# EAGLE design G-MAS SHIELD (EAGLE 9.4.2)
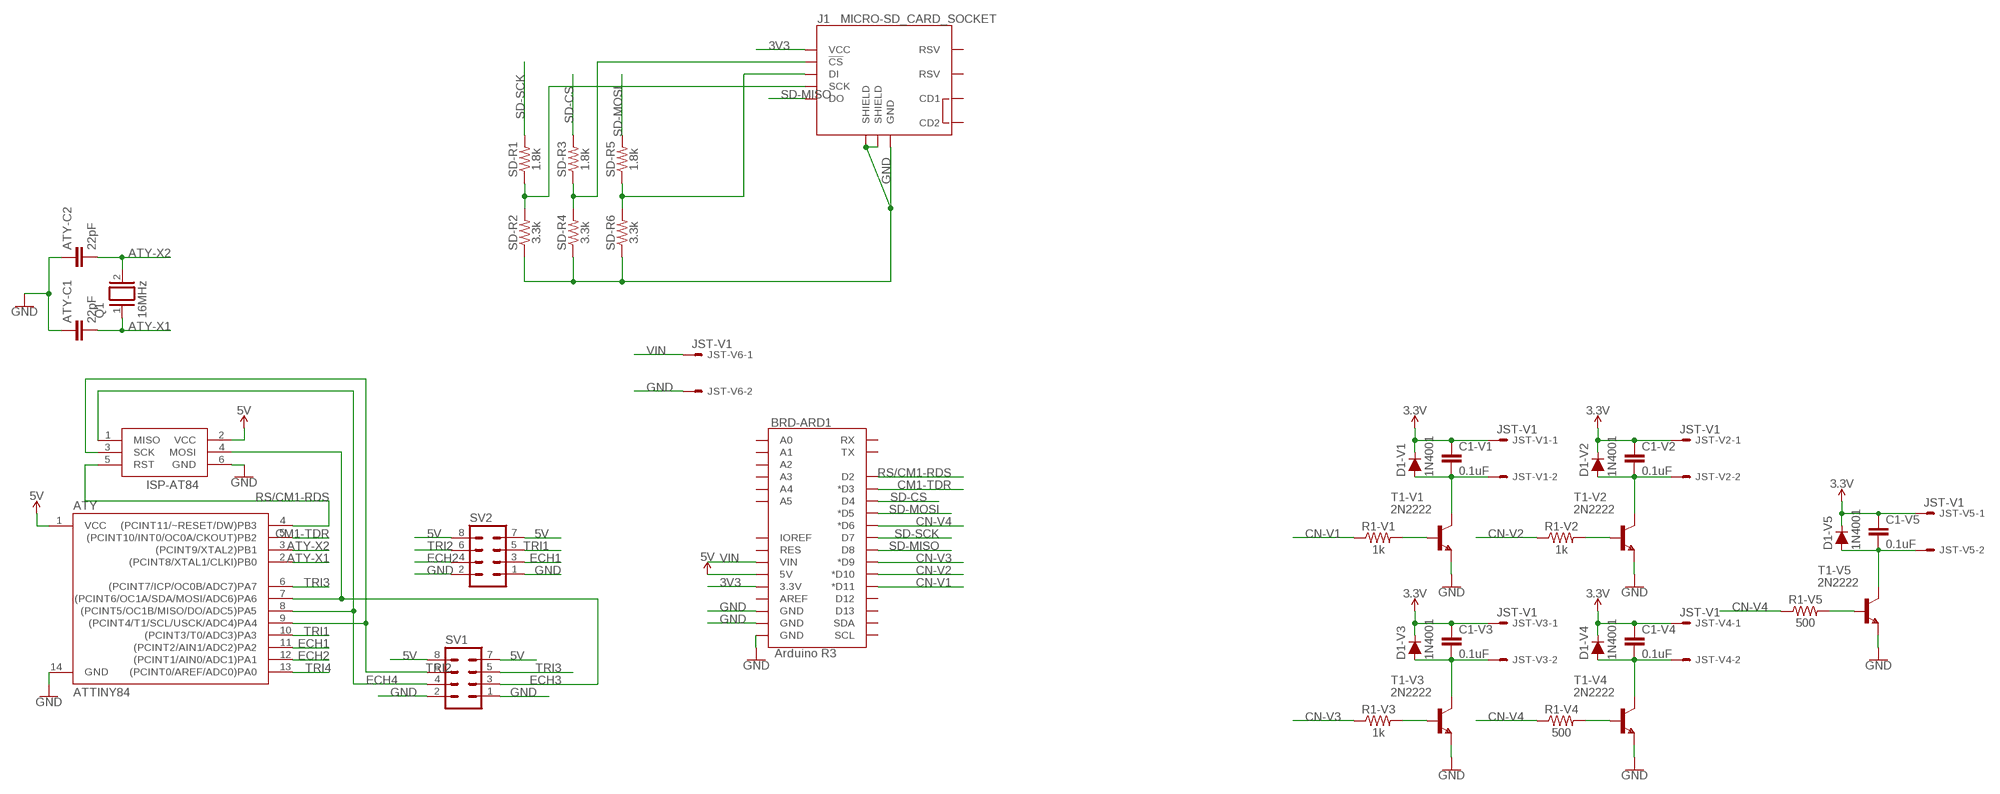
[diagram p0: schematic, sheet 1]

## Parts
ATY  ATTINY84  ATTINY84ATTINY84-20PU  [DIP14]
ATY-C1  22pF  0.1UF-KIT-EZ-50V-20%  [CAP-PTH-SMALL-KIT]
ATY-C2  22pF  0.1UF-KIT-EZ-50V-20%  [CAP-PTH-SMALL-KIT]
BRD-ARD1  Arduino R3  ARDUINO_UNO_R3_SHIELDNOLABELS  [UNO_R3_SHIELD_NOLABELS]
C1-V1  0.1uF  0.1UF-KIT-EZ-50V-20%  [CAP-PTH-SMALL-KIT]
C1-V2  0.1uF  0.1UF-KIT-EZ-50V-20%  [CAP-PTH-SMALL-KIT]
C1-V3  0.1uF  0.1UF-KIT-EZ-50V-20%  [CAP-PTH-SMALL-KIT]
C1-V4  0.1uF  0.1UF-KIT-EZ-50V-20%  [CAP-PTH-SMALL-KIT]
C1-V5  0.1uF  0.1UF-KIT-EZ-50V-20%  [CAP-PTH-SMALL-KIT]
D1-V1  1N4001  DIODE-PTH  [DIODE-1N4001]
D1-V2  1N4001  DIODE-PTH  [DIODE-1N4001]
D1-V3  1N4001  DIODE-PTH  [DIODE-1N4001]
D1-V4  1N4001  DIODE-PTH  [DIODE-1N4001]
D1-V5  1N4001  DIODE-PTH  [DIODE-1N4001]
ISP-AT84  AVRISP-6  [AVRISP]
J1  MICRO-SD_CARD_SOCKET  [MICRO-SD-SOCKET]
JST-V1  JST-V1  JST-XH-02-PIN-LONG-PAD  [JST-XH-02-PACKAGE-LONG-PAD]
JST-V2  JST-V1  JST-XH-02-PIN-LONG-PAD  [JST-XH-02-PACKAGE-LONG-PAD]
JST-V3  JST-V1  JST-XH-02-PIN-LONG-PAD  [JST-XH-02-PACKAGE-LONG-PAD]
JST-V4  JST-V1  JST-XH-02-PIN-LONG-PAD  [JST-XH-02-PACKAGE-LONG-PAD]
JST-V5  JST-V1  JST-XH-02-PIN-LONG-PAD  [JST-XH-02-PACKAGE-LONG-PAD]
JST-V6  JST-V1  JST-XH-02-PIN-LONG-PAD  [JST-XH-02-PACKAGE-LONG-PAD]
Q1  16MHz  XTAL/S  [QS]
R1-V1  1k  1KOHM-HORIZ-1/4W-1%  [AXIAL-0.3]
R1-V2  1k  1KOHM-HORIZ-1/4W-1%  [AXIAL-0.3]
R1-V3  1k  1KOHM-HORIZ-1/4W-1%  [AXIAL-0.3]
R1-V4  500  1KOHM-HORIZ-1/4W-1%  [AXIAL-0.3]
R1-V5  500  1KOHM-HORIZ-1/4W-1%  [AXIAL-0.3]
SD-R1  1.8k  1.8KOHM-0603-1/10W-1%  [0603]
SD-R2  3.3k  3.3KOHM-0603-1/10W-1%  [0603]
SD-R3  1.8k  1.8KOHM-0603-1/10W-1%  [0603]
SD-R4  3.3k  3.3KOHM-0603-1/10W-1%  [0603]
SD-R5  1.8k  1.8KOHM-0603-1/10W-1%  [0603]
SD-R6  3.3k  3.3KOHM-0603-1/10W-1%  [0603]
SV1  MA04-2  [MA04-2]
SV2  MA04-2  [MA04-2]
T1-V1  2N2222  [TO92-EBC-OVAL]
T1-V2  2N2222  [TO92-EBC-OVAL]
T1-V3  2N2222  [TO92-EBC-OVAL]
T1-V4  2N2222  [TO92-EBC-OVAL]
T1-V5  2N2222  [TO92-EBC-OVAL]

## Nets
3.3V: C1-V1.1 C1-V2.1 C1-V3.1 C1-V4.1 C1-V5.1 D1-V1.C D1-V2.C D1-V3.C D1-V4.C D1-V5.C JST-V1.1 JST-V2.1 JST-V3.1 JST-V4.1 JST-V5.1
3V3: BRD-ARD1.3.3V J1.VCC
5V: ATY.1(VCC) BRD-ARD1.5V ISP-AT84.2(VCC) SV1.7 SV1.8 SV2.7 SV2.8
ATY-X1: ATY-C1.2 ATY.2((PCINT8/XTAL1/CLKI)PB0) Q1.1
ATY-X2: ATY-C2.2 ATY.3((PCINT9/XTAL2)PB1) Q1.2
CM1-TDR: ATY.5((PCINT10/INT0/OC0A/CKOUT)PB2) BRD-ARD1.D3(*D3)
CN-V1: BRD-ARD1.D11(*D11) R1-V1.P$1
CN-V2: BRD-ARD1.D10(*D10) R1-V2.P$1
CN-V3: BRD-ARD1.D9(*D9) R1-V3.P$1
CN-V4: BRD-ARD1.D6(*D6) R1-V4.P$1 R1-V5.P$1
ECH1: ATY.11((PCINT2/AIN1/ADC2)PA2) SV2.3
ECH2: ATY.12((PCINT1/AIN0/ADC1)PA1) SV2.4
ECH3: ATY.7((PCINT6/OC1A/SDA/MOSI/ADC6)PA6) ISP-AT84.4(MOSI) SV1.3
ECH4: ATY.8((PCINT5/OC1B/MISO/DO/ADC5)PA5) ISP-AT84.1(MISO) SV1.4
GND: ATY-C1.1 ATY-C2.1 ATY.14(GND) BRD-ARD1.GND@0(GND) BRD-ARD1.GND@1(GND) BRD-ARD1.GND@2(GND) ISP-AT84.6(GND) J1.GND J1.GND1(SHIELD) J1.GND3(SHIELD) JST-V6.2 SD-R2.1 SD-R4.1 SD-R6.1 SV1.1 SV1.2 SV2.1 SV2.2 T1-V1.E T1-V2.E T1-V3.E T1-V4.E T1-V5.E
N$1: C1-V1.2 D1-V1.A JST-V1.2 T1-V1.C
N$2: C1-V2.2 D1-V2.A JST-V2.2 T1-V2.C
N$3: R1-V1.P$2 T1-V1.B
N$4: R1-V2.P$2 T1-V2.B
N$5: C1-V3.2 D1-V3.A JST-V3.2 T1-V3.C
N$6: R1-V3.P$2 T1-V3.B
N$7: C1-V4.2 D1-V4.A JST-V4.2 T1-V4.C
N$8: R1-V4.P$2 T1-V4.B
N$9: C1-V5.2 D1-V5.A JST-V5.2 T1-V5.C
N$10: R1-V5.P$2 T1-V5.B
N$11: J1.SCLK(SCK) SD-R1.1 SD-R2.2
N$12: J1.CS(!CS) SD-R3.1 SD-R4.2
N$13: J1.DI SD-R5.1 SD-R6.2
RS/CM1-RDS: ATY.4((PCINT11/~RESET/DW)PB3) BRD-ARD1.D2 ISP-AT84.5(RST)
SD-CS: BRD-ARD1.D4 SD-R3.2
SD-MISO: BRD-ARD1.D8 J1.DO
SD-MOSI: BRD-ARD1.D5(*D5) SD-R5.2
SD-SCK: BRD-ARD1.D7 SD-R1.2
TRI1: ATY.10((PCINT3/T0/ADC3)PA3) SV2.5
TRI2: ATY.13((PCINT0/AREF/ADC0)PA0) SV2.6
TRI3: ATY.6((PCINT7/ICP/OC0B/ADC7)PA7) SV1.5
TRI4: ATY.9((PCINT4/T1/SCL/USCK/ADC4)PA4) ISP-AT84.3(SCK) SV1.6
VIN: BRD-ARD1.VIN JST-V6.1
Unconnected: BRD-ARD1.A0 BRD-ARD1.A1 BRD-ARD1.A2 BRD-ARD1.A3 BRD-ARD1.A4 BRD-ARD1.A5 BRD-ARD1.AREF BRD-ARD1.D12 BRD-ARD1.D13 BRD-ARD1.IOREF BRD-ARD1.RES BRD-ARD1.RX BRD-ARD1.SCL BRD-ARD1.SDA BRD-ARD1.TX J1.CD1 J1.CD2 J1.RSV1(RSV) J1.RSV2(RSV)

## Library data of the parts
ATY = SparkFun-IC-Microcontroller:ATTINY84: Atmel 14-pin 2/4/8kB flash uC Datasheet <https://cdn.sparkfun.com/datasheets/Widgets/doc8006.pdf> SparkFun Products Tiny AVR Programmer <https://www.sparkfun.com/products/11801> (PGM-11801) SparkFun Servo Trigger - Continuous Rotation <https://www.sparkfun.com/products/13872> (WIG-13872) SparkFun Servo Trigger <https://www.sparkfun.com/products/13118> (WIG-13118)
ATY-C1 ATY-C2 = SparkFun-Capacitors:0.1UF: 0.1µF ceramic capacitors A capacitor is a passive two-terminal electrical component used to store electrical energy temporarily in an electric field.; PROD_ID: CAP-08370; VALUE: 0.1uF
BRD-ARD1 = SparkFun-Boards:ARDUINO_UNO_R3_SHIELD: Arduino R3 Shield Footprint Shield form compatible with the Arduino Uno R3. SparkFun Products: MG2639 Cellular Shield <https://www.sparkfun.com/products/13120> MIDI Shield <https://www.sparkfun.com/products/12898> R3 Stackable Headers Kit <https://www.sparkfun.com/products/11417>
C1-V1-C1-V5 = SparkFun-Capacitors:0.1UF: 0.1µF ceramic capacitors A capacitor is a passive two-terminal electrical component used to store electrical energy temporarily in an electric field.; PROD_ID: CAP-08370
D1-V1-D1-V5 = SparkFun-DiscreteSemi:DIODE: Diode These are standard reverse protection diodes and small signal diodes. SparkFun Products: SparkFun SparkPunk Sound Kit <https://www.sparkfun.com/products/11177> SparkFun ESP8266 Thing <https://www.sparkfun.com/products/13231>; PROD_ID: DIO-09176; VALUE: 1A/50V/1.1V
ISP-AT84 = adafruit:AVRISP: AVR ISP HEADER Standard 6 pin header for AVR programming
J1 = SparkFun-Connectors:MICRO-SD_CARD_SOCKET: microSD Socket for Transflash Push-push type µSD socket. tDoc lines correctly indicate media card edge positions when inserting (unlocked, locked, depressed). NOTE: CD1 and CD2 are connected internally, and the default detect state of the socket is detect pin to ground. SparkFun Products: WAV Trigger <https://www.sparkfun.com/products/13660> CAN-Bus Shield <https://www.sparkfun.com/products/13262> SparkFun Level Shifing microSD Breakout <https://www.sparkfun.com/products/13743>; PROD_ID: CONN-07820; SF_ID: PRT-00127
JST-V1-JST-V6 = Rembrandt Electronics - JST XH Connectors v1-0:JST-XH-02-PIN: JST XH Connector 2 Pin Wire to board connector. Pitch: 2,54 mm, (0.100") Number of pins: 2 Created by Rembrandt Electronics www.rembrandtelectronics.com
Q1 = special:XTAL/S: CRYSTAL
R1-V1-R1-V3 = SparkFun-Resistors:1KOHM: 1kΩ resistor A resistor is a passive two-terminal electrical component that implements electrical resistance as a circuit element. Resistors act to reduce current flow, and, at the same time, act to lower voltage levels within circuits. - Wikipedia; PROD_ID: RES-12182
R1-V4 R1-V5 = SparkFun-Resistors:1KOHM: 1kΩ resistor A resistor is a passive two-terminal electrical component that implements electrical resistance as a circuit element. Resistors act to reduce current flow, and, at the same time, act to lower voltage levels within circuits. - Wikipedia; PROD_ID: RES-12182; VALUE: 1k
SD-R1 SD-R3 SD-R5 = SparkFun-Resistors:1.8KOHM: 1.8kΩ resistor A resistor is a passive two-terminal electrical component that implements electrical resistance as a circuit element. Resistors act to reduce current flow, and, at the same time, act to lower voltage levels within circuits. - Wikipedia; PROD_ID: RES-09119
SD-R2 SD-R4 SD-R6 = SparkFun-Resistors:3.3KOHM: 3.3kΩ resistor A resistor is a passive two-terminal electrical component that implements electrical resistance as a circuit element. Resistors act to reduce current flow, and, at the same time, act to lower voltage levels within circuits. - Wikipedia; PROD_ID: RES-07851
SV1 SV2 = con-lstb:MA04-2: PIN HEADER; OC_FARNELL: unknown; OC_NEWARK: unknown
T1-V1-T1-V5 = adafruit:2N2222: NPN TRANSISTOR Big oval pads

## Net classes
0 default: width 1.016 mm, clearance 0.635 mm

## Board
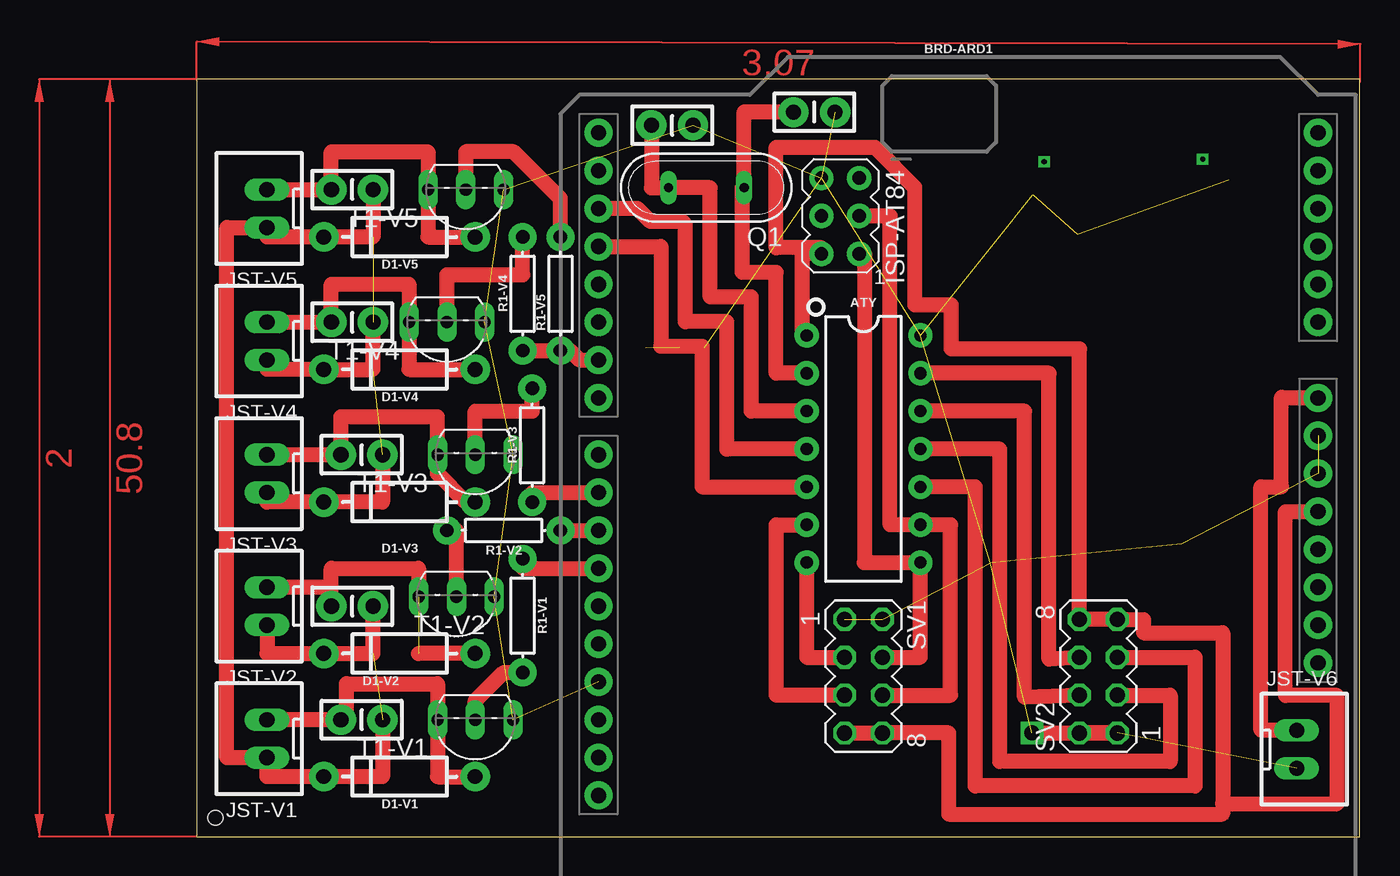
[diagram p1: board, top side]
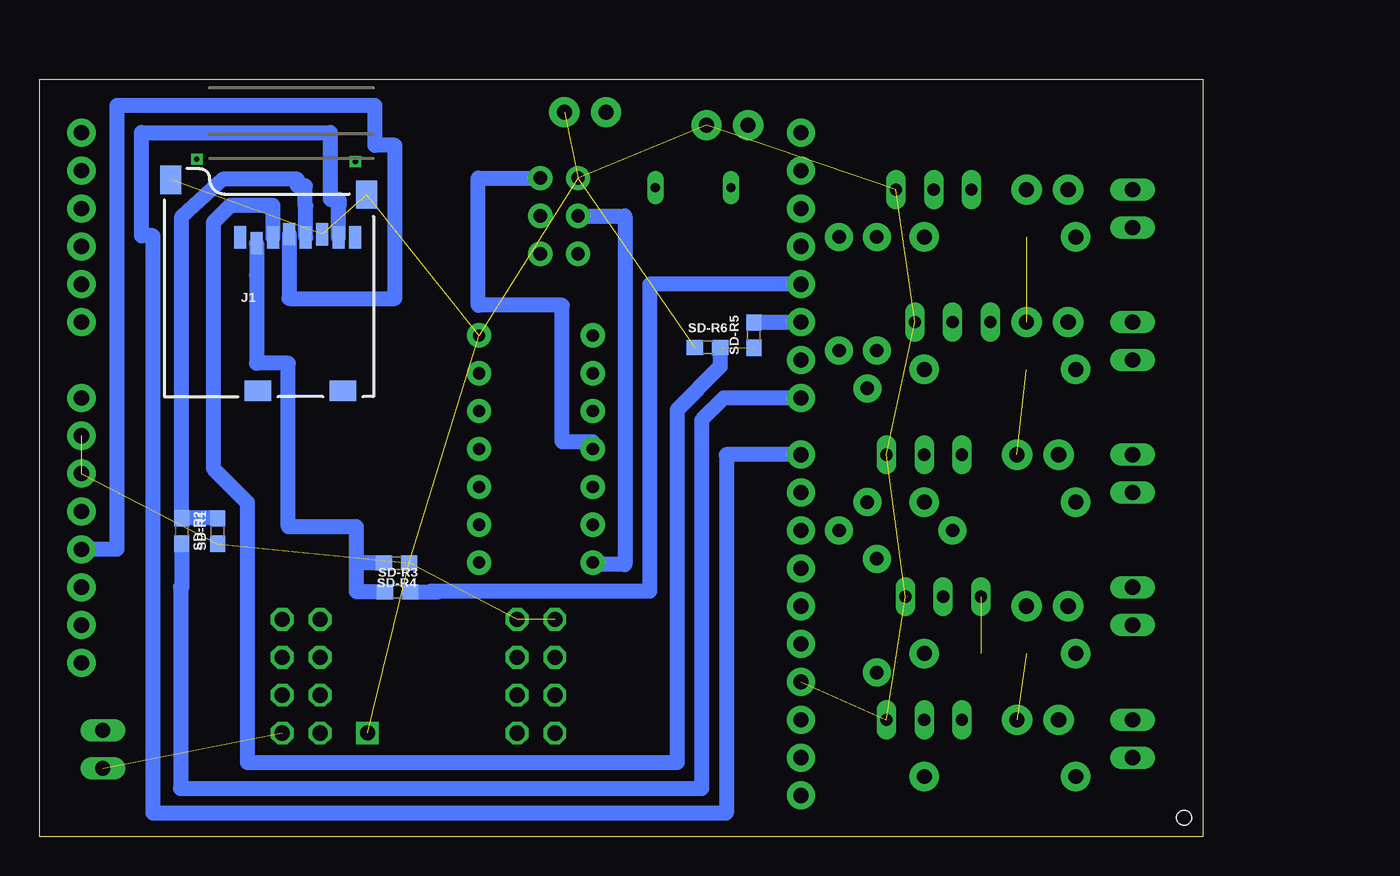
[diagram p2: board, bottom side, seen from below]

Size 78 x 50.8 mm. Coordinates in mm from the lower left corner, seen from the top.
Outline: 0,0 78,0 78,50.8 0,50.8 0,0
Copper layers (1*16): Top 0.035mm / dielectric 1.5mm / Bottom 0.035mm
Design rules "default": minimum track width 6mil, minimum drill 0.35mm, track to track 6mil, track to pad 6mil, pad to pad 6mil, via to via 6mil, smd to smd 6mil, copper to edge 40mil, drill to drill 6mil, minimum pad ring 10mil, minimum via ring 8mil, stop-mask expansion 4mil, vias tented up to drill 0mil, thermal gap 10mil
Holes 1 mm at 1.27,1.27

### Footprints (pad centres in the part's own frame; a part is rotated, then mirrored left to right if it is on the bottom)
DIP14 = drill 0.813 pad 1.626: 1 -7.62,-3.81; 2 -5.08,-3.81; 3 -2.54,-3.81; 4 0,-3.81; 5 2.54,-3.81; 6 5.08,-3.81; 7 7.62,-3.81; 8 7.62,3.81; 9 5.08,3.81; 10 2.54,3.81; 11 0,3.81; 12 -2.54,3.81; 13 -5.08,3.81; 14 -7.62,3.81
CAP-PTH-SMALL-KIT = drill 1.016 pad 2.032: 1 -1.397,0; 2 1.397,0
UNO_R3_SHIELD_NOLABELS = drill 1.016 pad 1.88: 3.3V 24.13,-3.81; 5V 24.13,-1.27; A0 24.13,11.43; A1 24.13,13.97; A2 24.13,16.51; A3 24.13,19.05; A4 24.13,21.59; A5 24.13,24.13; AREF -24.13,-15.24; D2 -24.13,19.05; D3 -24.13,16.51; D4 -24.13,13.97; D5 -24.13,11.43; D6 -24.13,8.89; D7 -24.13,6.35; D8 -24.13,2.54; D9 -24.13,0; D10 -24.13,-2.54; D11 -24.13,-5.08; D12 -24.13,-7.62; D13 -24.13,-10.16; GND@0 24.13,1.27; GND@1 24.13,3.81; GND@2 -24.13,-12.7; IOREF 24.13,-8.89; NC 24.13,-11.43; RES 24.13,-6.35; RX -24.13,24.13; SCL -24.13,-20.32; SDA -24.13,-17.78; TX -24.13,21.59; VIN 24.13,6.35
DIODE-1N4001 = drill 1 pad 1.981: A -5.08,0; C 5.08,0
AVRISP = drill 0.9 pad 1.626: 1 -1.27,2.54; 2 1.27,2.54; 3 -1.27,0; 4 1.27,0; 5 -1.27,-2.54; 6 1.27,-2.54
MICRO-SD-SOCKET = smd 1.8 x 1.4: CD1 -2.05,0.4; CD2 -7.75,0.4 | smd 0.8 x 1.5: CS -7.84,10.3; DI -6.74,10.7; DO -2.34,10.7; GND -3.44,10.9; RSV1 -8.94,10.7; RSV2 -1.24,10.7; SCLK -4.54,10.7; VCC -5.64,10.9 | smd 1.4 x 1.9: GND1 -13.6,14.55; GND3 -0.45,13.55
JST-XH-02-PACKAGE-LONG-PAD = drill 1.016 long: 1 -1.27,0; 2 1.27,0
QS = drill 0.61 long: 1 -2.54,0; 2 2.54,0
AXIAL-0.3 = drill 0.9 pad 1.88: P$1 -3.81,0; P$2 3.81,0
0603 = smd 1.1 x 1: 1 -0.85,0; 2 0.85,0
MA04-2 = drill 1.016 octagon: 1 -3.81,-1.27; 2 -3.81,1.27; 3 -1.27,-1.27; 4 -1.27,1.27; 5 1.27,-1.27; 6 1.27,1.27; 7 3.81,-1.27; 8 3.81,1.27
TO92-EBC-OVAL = drill 0.813 long: B 0,-1.27; C 2.54,-1.27; E -2.54,-1.27

### Placement (x,y rotation side)
ATY  44.72,26.01 270 top
ATY-C1  41.42,48.6 180 top
ATY-C2  31.9,47.73 180 top
BRD-ARD1  51.07,23.09 0 top
C1-V1  11.07,7.85 180 top
C1-V2  10.43,15.47 180 top
C1-V3  11.07,25.63 180 top
C1-V4  10.43,34.52 180 top
C1-V5  10.43,43.41 180 top
D1-V1  13.61,4.04 180 top
D1-V2  13.61,12.29 180 top
D1-V3  13.61,22.45 180 top
D1-V4  13.61,31.34 180 top
D1-V5  13.61,40.23 180 top
ISP-AT84  43.17,41.64 180 top
J1  55.62,29.51 0 bottom
JST-V1  4.72,6.58 90 top
JST-V2  4.72,15.47 90 top
JST-V3  4.72,24.36 90 top
JST-V4  4.72,33.25 90 top
JST-V5  4.72,42.14 90 top
JST-V6  73.77,5.87 270 top
Q1  34.18,43.53 180 top
R1-V1  21.86,14.83 270 top
R1-V2  20.59,20.55 180 top
R1-V3  22.5,26.26 90 top
R1-V4  21.86,36.42 90 top
R1-V5  24.4,36.42 90 top
SD-R1  68.48,20.52 270 bottom
SD-R2  66.06,20.5 90 bottom
SD-R3  54,16.42 0 bottom
SD-R4  54.08,18.35 180 bottom
SD-R5  30.11,33.64 90 bottom
SD-R6  33.22,32.82 0 bottom
SV1  44.72,10.77 270 top
SV2  60.47,10.77 90 top
T1-V1  18.69,6.58 180 top
T1-V2  17.42,14.83 180 top
T1-V3  18.69,24.36 180 top
T1-V4  16.78,33.25 180 top
T1-V5  18.05,42.14 180 top

### Tracks (layer width: path | path; a pad name or v marks a point on that pad's centre or on a via)
3.3V  (3 unrouted)
  Top 1.016: C1-V1.1 12.46,4.04 D1-V1.C 4.72,4.04 JST-V1.1 2.02,5.31 2.02,40.87 JST-V5.1 4.72,40.23 D1-V5.C 11.83,40.23 C1-V5.1 | JST-V2.1 4.72,12.29 D1-V2.C 11.83,12.29 C1-V2.1 | JST-V3.1 4.72,22.45 D1-V3.C 12.46,22.45 C1-V3.1 | C1-V4.1 11.83,31.34 D1-V4.C 4.72,31.34 JST-V4.1
3V3
  Bottom 1.016: J1.VCC 61.26,36.11 | 61.26,36.11 61.28,36.11 | 61.26,36.11 54.17,36.11 54.17,46.38 55.52,46.38 55.52,49.05 72.83,49.05 72.83,19.28 BRD-ARD1.3.3V
5V
  Top 1.016: SV1.7 SV1.8 50.44,6.96 50.44,1.52 68.78,1.52 68.81,1.56 68.81,2.21 | ATY.1 40.61,33.93 40.61,39.1 ISP-AT84.2 41.9,39.51 38.85,39.51 38.85,46.24 45.5,46.24 48.15,43.58 48.15,35.69 50.59,35.69 50.59,32.74 59.2,32.74 SV2.8 SV2.7 63.49,14.58 63.49,13.69 68.81,13.69 68.81,2.21 | 68.81,2.21 76.48,2.21 76.48,9.29 | 76.48,9.29 76.38,9.29 | 76.48,9.29 76.48,9.47 73.02,9.47 73.02,21.82 BRD-ARD1.5V
ATY-X1
  Top 1.016: ATY-C1.2 36.72,48.6 Q1.1 36.59,43.53 36.59,37.86 38.85,37.86 38.85,31.09 ATY.2
ATY-X2
  Top 1.016: ATY-C2.2 30.5,43.53 Q1.2 34.44,43.53 34.44,36.21 37.2,36.21 37.2,28.55 ATY.3
CM1-TDR
  Top 1.016: BRD-ARD1.D3 31.13,39.6 31.13,32.9 33.9,32.9 33.9,23.47 ATY.5
CN-V1
  Top 1.016: R1-V1.P$1 21.86,18.01 BRD-ARD1.D11
CN-V2
  Top 1.016: R1-V2.P$1 BRD-ARD1.D10
CN-V3
  Top 1.016: R1-V3.P$1 22.5,23.09 BRD-ARD1.D9
CN-V4
  Top 1.016: R1-V4.P$1 R1-V5.P$1 25.04,32.61 25.67,31.98 BRD-ARD1.D6
ECH1
  Top 1.016: SV2.3 65.3,9.5 65.3,5.05 53.87,5.05 53.87,26.01 ATY.11
ECH2
  Top 1.016: SV2.4 55.52,9.37 55.52,28.55 ATY.12
ECH3
  Top 1.016: ATY.7 40.91,12.04 SV1.3
  Bottom 1.016: ISP-AT84.4 38.75,41.64 38.75,18.26 40.91,18.26 ATY.7
ECH4
  Top 1.016: SV1.4 48.53,12.04 ATY.8 44.77,18.39 44.77,39.18 44.52,39.18 ISP-AT84.1
GND  (via drill 1)  (21 unrouted)
  Top 1.016: SV2.2 SV2.1 v56.03,6.96
N$1
  Top 1.016: D1-V1.A 16.15,4.04 T1-V1.C 16.15,10.26 10.05,10.26 10.05,7.85 C1-V1.2 JST-V1.2
N$2  (1 unrouted)
  Top 1.016: D1-V2.A 14.88,12.29 | C1-V2.2 9.04,16.74 | 9.04,16.74 JST-V2.2 | 9.04,16.74 9.04,18.01 14.88,18.01 T1-V2.C
N$3
  Top 1.016: T1-V1.B 18.69,9.12 20.59,11.02 R1-V1.P$2
N$4
  Top 1.016: T1-V2.B 17.42,20.55 R1-V2.P$2
N$5
  Top 1.016: JST-V3.2 C1-V3.2 9.67,28.17 16.15,28.17 T1-V3.C 16.15,24.36 18.05,22.45 D1-V3.A
N$6
  Top 1.016: T1-V3.B 18.69,28.55 22.5,28.55 R1-V3.P$2
N$7
  Top 1.016: JST-V4.2 C1-V4.2 9.04,37.06 14.24,37.06 T1-V4.C 14.24,31.34 D1-V4.A
N$8
  Top 1.016: T1-V4.B 16.78,37.69 21.86,37.69 R1-V4.P$2
N$9
  Top 1.016: D1-V5.A 15.51,40.23 T1-V5.C 15.51,45.95 9.04,45.95 C1-V5.2 JST-V5.2
N$10
  Top 1.016: R1-V5.P$2 24.4,42.81 21.26,45.95 18.05,45.95 T1-V5.B
N$11
  Bottom 1.016: J1.SCLK 60.16,42.31 60.19,42.31 60.19,43.66 60.71,43.66 60.71,44.1 65.75,44.1 68.47,41.6 SD-R1.1 66.06,21.37 SD-R2.2
N$12
  Bottom 1.016: J1.CS 63.46,37.66 63.47,37.66 63.47,31.76 61.33,31.76 61.33,20.78 56.75,20.78 56.75,18.49 56.75,18.36 | SD-R3.1 56.75,16.42 56.75,18.36 | SD-R4.2 56.75,18.36
N$13  (1 unrouted)
  Bottom 1.016: SD-R6.2 32.38,31.52 35.26,28.64 35.26,4.96 64.08,4.96 64.08,22.43 66.36,24.71 66.36,41.2 65.22,42.34 62.36,42.34 J1.DI
N$14  (via drill 0.35)
  other vias: 67.47,45.45
N$15  (via drill 0.35)
  other vias: 56.83,45.28
RS/CM1-RDS
  Top 1.016: ATY.4 35.55,26.01 35.55,34.55 32.78,34.55 32.78,41.07 32.58,41.27 30.43,41.27 29.56,42.14 BRD-ARD1.D2
  Bottom 1.016: ATY.4 40.91,26.49 42.97,26.49 42.97,35.66 48.6,35.66 48.6,44.18 ISP-AT84.5
SD-CS
  Bottom 1.016: BRD-ARD1.D4 37.1,37.06 37.1,16.46 51.22,16.46 | 51.22,16.46 51.77,16.46 | SD-R3.2 51.22,16.42 51.22,16.46
SD-MISO
  Bottom 1.016: BRD-ARD1.D8 31.96,25.63 31.96,1.58 70.21,1.58 | 70.21,1.69 70.21,1.58 | 70.21,1.58 70.4,1.58 70.4,40.32 71.17,40.32 71.17,47.23 58.51,47.23 58.51,42.74 57.96,42.74 | 57.94,42.31 57.94,42.74 57.96,42.74 | J1.DO 57.96,42.74
SD-MOSI
  Bottom 1.016: BRD-ARD1.D5 26.94,34.49 SD-R5.2
SD-SCK
  Bottom 1.016: BRD-ARD1.D7 32.13,29.44 33.61,27.95 33.61,3.23 68.56,3.23 68.56,16.76 68.47,16.76 SD-R1.2
TRI1
  Top 1.016: SV2.5 66.95,12.04 66.95,3.4 52.22,3.4 52.22,23.47 ATY.10
TRI2
  Top 1.016: SV2.6 57.17,11.9 57.17,31.09 ATY.13
TRI3
  Top 1.016: SV1.5 38.88,9.5 38.88,20.93 ATY.6
TRI4
  Top 1.016: SV1.6 50.56,9.5 50.56,20.93 ATY.9 46.5,20.93 46.5,41.64 ISP-AT84.3
VIN
  Top 1.016: BRD-ARD1.VIN 75.2,29.47 72.75,29.47 72.75,23.47 71.37,23.47 71.37,7.14 JST-V6.1
(copper drawn outside any net)
  shapes: Top area x3